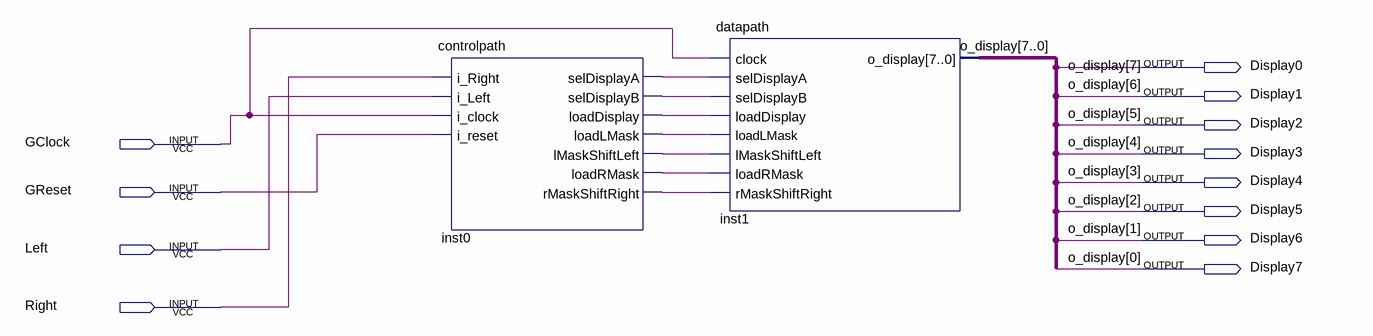
[diagram p0: schematic sheet]
// Quartus schematic LightDisplayControler.bdf as structural Verilog: 2 symbols, 12 pins
module LightDisplayControler (
  input  GClock,
  input  GReset,
  input  Left,
  input  Right,
  output Display0,
  output Display1,
  output Display2,
  output Display3,
  output Display4,
  output Display5,
  output Display6,
  output Display7
);

  wire inst0_lmaskshiftleft, inst0_loaddisplay, inst0_loadlmask, inst0_loadrmask, inst0_rmaskshiftright,
       inst0_seldisplaya, inst0_seldisplayb;

  controlpath inst0 (
    .i_Right(Right), .i_Left(Left), .i_clock(GClock), .i_reset(GReset), .selDisplayA(inst0_seldisplaya),
    .selDisplayB(inst0_seldisplayb), .loadDisplay(inst0_loaddisplay), .loadLMask(inst0_loadlmask),
    .lMaskShiftLeft(inst0_lmaskshiftleft), .loadRMask(inst0_loadrmask),
    .rMaskShiftRight(inst0_rmaskshiftright));
  datapath inst1 (
    .clock(GClock), .selDisplayA(inst0_seldisplaya), .selDisplayB(inst0_seldisplayb),
    .loadDisplay(inst0_loaddisplay), .loadLMask(inst0_loadlmask), .lMaskShiftLeft(inst0_lmaskshiftleft),
    .loadRMask(inst0_loadrmask), .rMaskShiftRight(inst0_rmaskshiftright),
    .o_display({Display0, Display1, Display2, Display3, Display4, Display5, Display6, Display7}));

  // Other names for the same wires on the sheet: o_display[7:0] = {Display0, Display1, Display2, Display3, Display4, Display5, Display6, Display7}
endmodule
